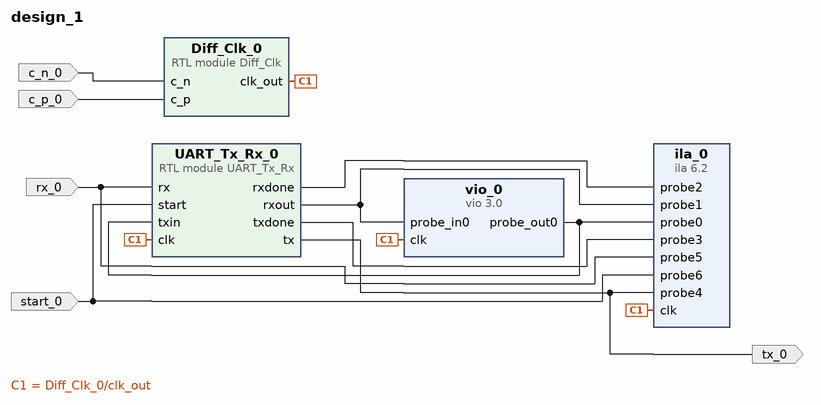
[diagram p0: block diagram of the top level]
# Vivado block design design_1, xczu2cg-sfvc784-1-e, Vivado 2023.1
create_bd_design design_1

create_bd_port -dir I c_p_0
create_bd_port -dir I c_n_0
create_bd_port -dir I start_0
create_bd_port -dir O tx_0
create_bd_port -dir I rx_0

create_bd_cell -type module -reference UART_Tx_Rx UART_Tx_Rx_0
create_bd_cell -type module -reference Diff_Clk Diff_Clk_0
create_bd_cell -type ip -vlnv xilinx.com:ip:ila:6.2 ila_0
set_property -dict [list \
  CONFIG.C_DATA_DEPTH 65536 \
  CONFIG.C_MONITOR_TYPE Native \
  CONFIG.C_NUM_OF_PROBES 7 \
  CONFIG.C_PROBE0_WIDTH 8 \
  CONFIG.C_PROBE1_WIDTH 8 \
] [get_bd_cells ila_0]
create_bd_cell -type ip -vlnv xilinx.com:ip:vio:3.0 vio_0
set_property -dict {CONFIG.C_PROBE_OUT0_WIDTH 8} [get_bd_cells vio_0]

# ---- connections ----

connect_bd_net [get_bd_pins Diff_Clk_0/clk_out] [get_bd_pins UART_Tx_Rx_0/clk] [get_bd_pins vio_0/clk] [get_bd_pins ila_0/clk]
connect_bd_net [get_bd_pins UART_Tx_Rx_0/rxdone] [get_bd_pins ila_0/probe2]
connect_bd_net [get_bd_pins UART_Tx_Rx_0/rxout] [get_bd_pins vio_0/probe_in0] [get_bd_pins ila_0/probe1]
connect_bd_net [get_bd_pins UART_Tx_Rx_0/tx] [get_bd_ports tx_0] [get_bd_pins ila_0/probe4]
connect_bd_net [get_bd_pins UART_Tx_Rx_0/txdone] [get_bd_pins ila_0/probe3]
connect_bd_net -net c_n_0_1 [get_bd_ports c_n_0] [get_bd_pins Diff_Clk_0/c_n]
connect_bd_net -net c_p_0_1 [get_bd_ports c_p_0] [get_bd_pins Diff_Clk_0/c_p]
connect_bd_net -net rx_0_1 [get_bd_ports rx_0] [get_bd_pins UART_Tx_Rx_0/rx] [get_bd_pins ila_0/probe5]
connect_bd_net -net start_0_1 [get_bd_ports start_0] [get_bd_pins UART_Tx_Rx_0/start] [get_bd_pins ila_0/probe6]
connect_bd_net [get_bd_pins vio_0/probe_out0] [get_bd_pins UART_Tx_Rx_0/txin] [get_bd_pins ila_0/probe0]

validate_bd_design
save_bd_design
